# Altium schematic sheet Soft Quad Schematic.SchDoc
size A4; SheetNumber: 1; SheetTotal: 1
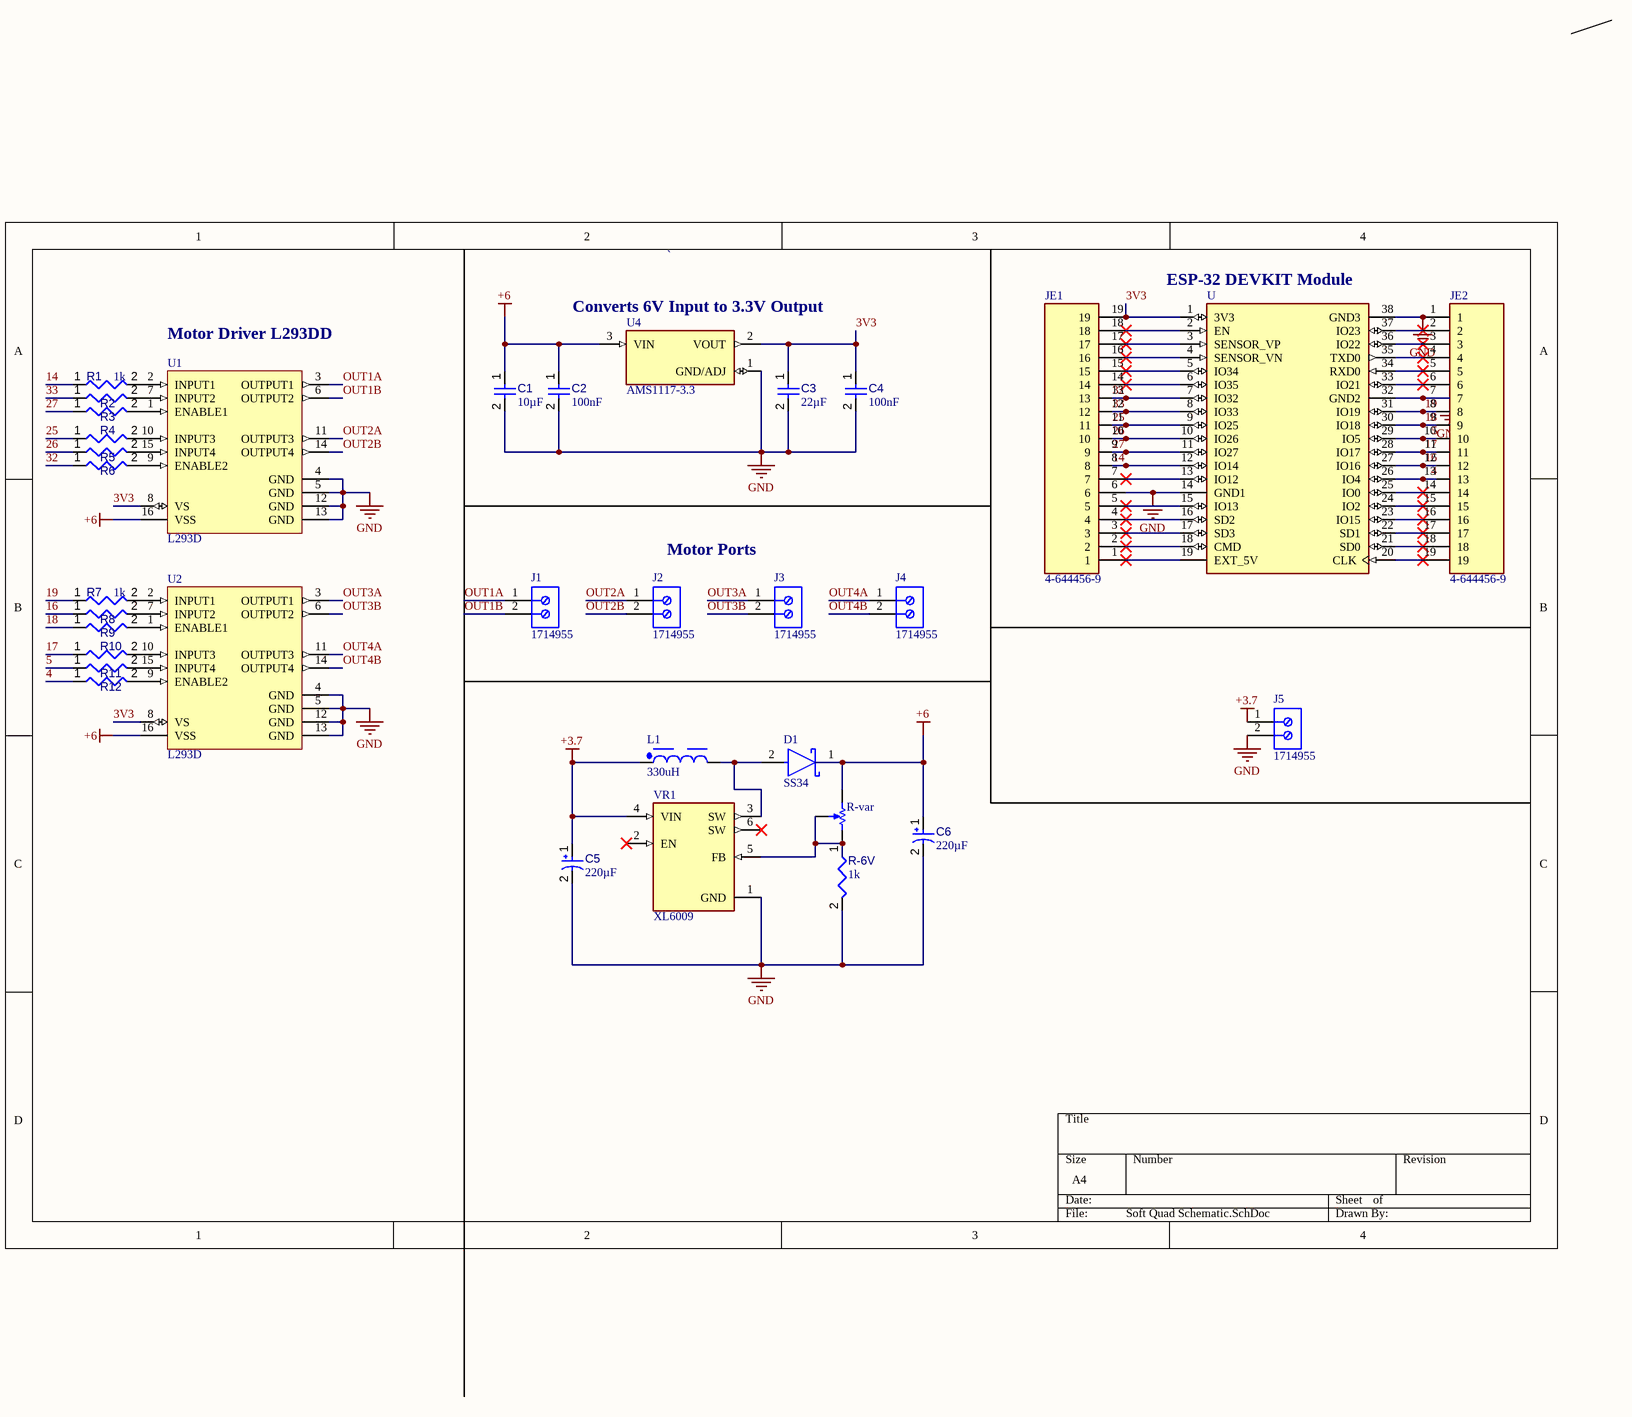
[diagram p0: Soft Quad Schematic.SchDoc]

## Parts
C1  value 10µF  [CAPC0603(1608)100_L]  (hidden comment: Capacitor 10µF +/-20% 10V 0603)
C2  value 100nF  [CAPC2013X95X50LL10T25]  (hidden comment: Capacitor 100 nF +/-10% 50 V 0805)
C3  value 22µF  [CAPC0805(2012)145_L]  (hidden comment: Capacitor 22µF +/-40% 16V 0805)
C4  value 100nF  [CAPC2013X95X50LL10T25]  (hidden comment: Capacitor 100 nF +/-10% 50 V 0805)
C5  value 220µF  [CAPMP7344X31-T_V]  (hidden comment: TPSD227K010R0150)
C6  value 220µF  [CAPMP7344X31-T_V]  (hidden comment: TPSD227K010R0150)
D1  SS34  [FP-95402-MFG]
J1  1714955  [PHOE-1714955_V]
J2  1714955  [PHOE-1714955_V]
J3  1714955  [PHOE-1714955_V]
J4  1714955  [PHOE-1714955_V]
J5  1714955  [PHOE-1714955_V]
JE1  4-644456-9  [TE_4-644456-9]
JE2  4-644456-9  [TE_4-644456-9]
L1  330uH  [WE-TPC_4818]
R1  value 1k  [RESC1608X55X25ML10T15]  (hidden comment: Resistor 1k +/-1% 0603 100 mW)
R2  Resistor 1k +/-1% 0603 100 mW  [RESC1608X55X25ML10T15]  (value not drawn)
R3  Resistor 1k +/-1% 0603 100 mW  [RESC1608X55X25ML10T15]  (value not drawn)
R4  Resistor 1k +/-1% 0603 100 mW  [RESC1608X55X25ML10T15]  (value not drawn)
R5  Resistor 1k +/-1% 0603 100 mW  [RESC1608X55X25ML10T15]  (value not drawn)
R6  Resistor 1k +/-1% 0603 100 mW  [RESC1608X55X25ML10T15]  (value not drawn)
R7  value 1k  [RESC1608X55X25ML10T15]  (hidden comment: Resistor 1k +/-1% 0603 100 mW)
R8  Resistor 1k +/-1% 0603 100 mW  [RESC1608X55X25ML10T15]  (value not drawn)
R9  Resistor 1k +/-1% 0603 100 mW  [RESC1608X55X25ML10T15]  (value not drawn)
R10  Resistor 1k +/-1% 0603 100 mW  [RESC1608X55X25ML10T15]  (value not drawn)
R11  Resistor 1k +/-1% 0603 100 mW  [RESC1608X55X25ML10T15]  (value not drawn)
R12  Resistor 1k +/-1% 0603 100 mW  [RESC1608X55X25ML10T15]  (value not drawn)
R-6V  value 1k  [RESC1608X55X25ML10T15]  (hidden comment: Resistor 1k +/-1% 0603 100 mW)
R-var  TC33X-2-103E  [BOUR-TC33X-2_V]  (value not drawn)
U  ESP32-DEVKITC  [MODULE_ESP32-DEVKITC]  (value not drawn)
U1  L293D  [STM-L293D-16]
U2  L293D  [STM-L293D-16]
U4  AMS1117-3.3  [SOT229P700X180-4N]
VR1  XL6009  [DPAK170P1435X465-6N]

## Nets
+3.7: C5.1 J5.1 L1.1 VR1.4(VIN)
+6: C1.1 C2.1 C6.1 D1.1(C) R-var.1 U1.16(VSS) U2.16(VSS) U4.3(VIN)
GND: C1.2 C2.2 C3.2 C4.2 C5.2 C6.2 J5.2 JE1.6 JE2.1 JE2.7 R-6V.2 U.14(GND1) U.32(GND2) U.38(GND3) U1.4(GND) U1.5(GND) U1.12(GND) U1.13(GND) U2.4(GND) U2.5(GND) U2.12(GND) U2.13(GND) U4.1(GND/ADJ) VR1.1(GND)
3V3: C3.1 C4.1 JE1.19 U.1(3V3) U1.8(VS) U2.8(VS) U4.2(VOUT)
4: JE2.13 R12.1 U.26(IO4)
5: JE2.10 R11.1 U.29(IO5)
14: JE1.8 R1.1 U.12(IO14)
16: JE2.12 R8.1 U.27(IO16)
17: JE2.11 R10.1 U.28(IO17)
18: JE2.9 R9.1 U.30(IO18)
19: JE2.8 R7.1 U.31(IO19)
25: JE1.11 R4.1 U.9(IO25)
26: JE1.10 R5.1 U.10(IO26)
27: JE1.9 R3.1 U.11(IO27)
32: JE1.13 R6.1 U.7(IO32)
33: JE1.12 R2.1 U.8(IO33)
OUT1A: J1.1 U1.3(OUTPUT1)
OUT1B: J1.2 U1.6(OUTPUT2)
OUT2A: J2.1 U1.11(OUTPUT3)
OUT2B: J2.2 U1.14(OUTPUT4)
OUT3A: J3.1 U2.3(OUTPUT1)
OUT3B: J3.2 U2.6(OUTPUT2)
OUT4A: J4.1 U2.11(OUTPUT3)
OUT4B: J4.2 U2.14(OUTPUT4)
NetD1_2: D1.2(A) L1.2 VR1.3(SW)
NetJE1_1: JE1.1 U.19(EXT_5V)
NetJE1_2: JE1.2 U.18(CMD)
NetJE1_3: JE1.3 U.17(SD3)
NetJE1_4: JE1.4 U.16(SD2)
NetJE1_5: JE1.5 U.15(IO13)
NetJE1_7: JE1.7 U.13(IO12)
NetJE1_14: JE1.14 U.6(IO35)
NetJE1_15: JE1.15 U.5(IO34)
NetJE1_16: JE1.16 U.4(SENSOR_VN)
NetJE1_17: JE1.17 U.3(SENSOR_VP)
NetJE1_18: JE1.18 U.2(EN)
NetJE2_2: JE2.2 U.37(IO23)
NetJE2_3: JE2.3 U.36(IO22)
NetJE2_4: JE2.4 U.35(TXD0)
NetJE2_5: JE2.5 U.34(RXD0)
NetJE2_6: JE2.6 U.33(IO21)
NetJE2_14: JE2.14 U.25(IO0)
NetJE2_15: JE2.15 U.24(IO2)
NetJE2_16: JE2.16 U.23(IO15)
NetJE2_17: JE2.17 U.22(SD1)
NetJE2_18: JE2.18 U.21(SD0)
NetJE2_19: JE2.19 U.20(CLK)
NetR1_2: R1.2 U1.2(INPUT1)
NetR2_2: R2.2 U1.7(INPUT2)
NetR3_2: R3.2 U1.1(ENABLE1)
NetR4_2: R4.2 U1.10(INPUT3)
NetR5_2: R5.2 U1.15(INPUT4)
NetR6_2: R6.2 U1.9(ENABLE2)
NetR7_2: R7.2 U2.2(INPUT1)
NetR8_2: R8.2 U2.7(INPUT2)
NetR9_2: R9.2 U2.1(ENABLE1)
NetR10_2: R10.2 U2.10(INPUT3)
NetR11_2: R11.2 U2.15(INPUT4)
NetR12_2: R12.2 U2.9(ENABLE2)
NetR-6V_1: R-6V.1 R-var.2 R-var.3 VR1.5(FB)

Not connected (* = marked no-connect by the designer): VR1 2(EN)* 6(SW)*

## Notes on the sheet
- `
- (near U4) Converts 6V Input to 3.3V Output
- (near U) ESP-32 DEVKIT Module
- Motor Driver L293DD
- Motor Ports

## Library data of the parts
C1 = CMP-001-00075-4: Chip Capacitor, 10µF +/-20%, 10V, 0603, Thickness 1 mm; Tolerance: 10%; Voltage Rating: 10V; Max Operating Temperature: 85°C; Pins: 2; Case/Package: 0603; Mounting Technology: SMT; Min Operating Temperature: -55°C
C2 C4 = CMP-001-00018-6: Chip Capacitor, 100 nF, +/- 10%, 50 V, 0805 (2012 Metric); Capacitor Type: Ceramic; Voltage Rating: 50V; Pins: 2; Max Operating Temperature: 125°C; Min Operating Temperature: -55°C; Mounting Technology: SM; Case/Package: 0805; RoHS Compliant: True; Tolerance: 10%
C3 = CMP-001-00081-4: Chip Capacitor, 22µF +/-40%, 16V, 0805, Thickness 1.45 mm; Tolerance: 5%; Voltage Rating: 16V; Mounting Technology: SMT; Pins: 2; Max Operating Temperature: 85°C; Case/Package: 0805; Min Operating Temperature: -55°C
C5 C6 = CMP-001-00051-7: Tantalum Capacitor, 220 uF, +/- 10%, 10 V, -55 to 125 degC, 2917 (7343 Metric), RoHS, Tape and Reel; Manufacturer: AVX Corporation; Voltage Rating: 10V; Case/Package: 2917; Datasheet URL: https://datasheet.ciiva.com/8080/1680477-8080379.pdf; Package Description: 2-Pin Surface Mount Device, Body 7.3 x 4.35 mm; Tolerance: 10%; RoHS Compliant: True; Capacitor Type: Tantalum; Manufacturer URL: http://www.avx.com/; Pins: 2; Package Quantity: 1; Max Operating Temperature: 125°C; Mounting Technology: SM; Packaging: TapeandReel; Datasheet Version: 42736; Package Reference: 7343-31; Min Operating Temperature: -55°C
D1 = CMP-02539-000012-1: DIODE SCHOTTKY 40V 3A DO214AB; Manufacturer: Vishay; Manufacturer Part Number: SS34-E3/57T; Max Junction Temp: +150°C; Peak Reverse Current: 0.5mA; Max Surge Forward Current: 100A; Standoff Height: 0mm; ComponentLink2Description: Datasheet; Device Class L3: Schottky Diodes; Height: 2.62mm; Max Repetitive Reverse Voltage: 40V; Lead Free: Yes; Package: 95402; Temperature Range High: +150°C; ComponentLink2URL: http://www.vishay.com/docs/88751/ss32.pdf; Temperature: -55°C to +150°C; Footprint Url: http://www.vishay.com/docs/95402/smc.pdf; Automotive: No; Forward Current: 3A; Category: Diode; RoHS: TRUE; Device Class L2: Diodes; Mouser Description: Schottky Diodes & Rectifiers 3.0 Amp 40 Volt; Octopart: https://octopart.com/ss34-e3%2F57t-vishay-39552907; Temperature Range Low: -55°C; Device Class L1: Discrete Semiconductors; Digikey Description: DIODE SCHOTTKY 40V 3A DO214AB
J1-J5 = CMP-2000-05797-1: PC Terminal Block, Pitch 6.35 mm, 1 x 2 Position, Height 21.5 mm, Tail Lenght 5.1 mm, RoHS, Bulk; Manufacturer: Phoenix Contact; Package Description: PC Terminal Block, Pitch 6.35 mm, 1 x 2 Position, Height 21.5 mm, Tail Lenght 5.1 mm; Datasheet URL: http://media.digikey.com/pdf/Data%20Sheets/Phoenix%20Contact%20PDFs/1714955.pdf; Package Reference: 1714955; Manufacturer URL: http://www.phoenixcontact.com/; Datasheet Version: 02/2010; Mounting Technology: ThroughHole
L1 = CMP-1479-00039-3: NexarPartId: 24533131; Inductance Tolerance: 30%; DC Resistance (DCR): 4.1Ω; Self Resonant Frequency: 5.5MHz; Current Rating: 150mA; Shielding: Shielded; Saturation Current: 130mA; Test Frequency: 100kHz; Inductance: 330µH; Core Material: Ferrite; Ambient Temperature Range Low: -40°C; REACH SVHC: Unknown; Termination: SMD/SMT; Min Operating Temperature: -40°C; RoHS: Compliant; Max Operating Temperature: 125°C; Packaging: Digi-Reel®; Max DC Current: 150mA; Case Code (Metric): 4848; Width: 4.8mm; Height: 1.8mm; Lead Free: Lead Free; Ambient Temperature Range High: 95°C; Height - Seated (Max): 2.0066mm; Case Code (Imperial): 1919; Case/Package: 1919; RMS Current (Irms): 150mA; Composition: Wirewound; Tolerance: 30%; Mount: Surface Mount; Length: 4.8mm; Number of Pins: 2
R1-R12 R-6V = CMP-009-00014-5: Chip Resistor, 1 KOhm, +/-1%, 0.1 W, -55 to 155 degC, 0603 (1608 Metric); Voltage Rating: 50V; Power: 100mW; Tolerance: 1%; Mounting Technology: SM; Pins: 2; Case/Package: 0603; Min Operating Temperature: -55°C; RoHS Compliant: True; Max Operating Temperature: 155°C
  R3-R6 R9-R12: Value: 1k
R-var = CMP-009-00060-2: Trimming Potentiometer, 10000 Ohm, -40 to 100 degC, 3-Pin SMD, RoHS, Tape and Reel; Manufacturer: Bourns; Tolerance: 25%; Power: 100mW; Resistance: 10k; Max Operating Temperature: 120°C; Package Description: 3-Pin Surface Mount Device, Body 3.8 x 3.6 mm; Datasheet Version: Aug-16; RoHS Compliant: True; Mounting Technology: SM; Package Quantity: 2500; Manufacturer URL: http://www.bourns.com/; Datasheet URL: http://www.bourns.com/docs/Product-Datasheets/TC33.pdf; Case/Package: TC33X-2; Package Reference: TC33X-2; Composition: Potentiometer; Packaging: TapeandReel; Min Operating Temperature: -40°C
U = ESP32-DEVKITC: - Transceiver; 802.11 b/g/n _Wi-Fi, WiFi, WLAN_, BluetoothÂ® Smart Ready 4.x Dual Mode For Use With ESP-WROOM-32; MP: ESP32-DEVKITC-32D-F; MF: Espressif Systems; Price: None; SnapEDA_Link: https://www.snapeda.com/parts/ESP32-DEVKITC-32D-F/Espressif%20Systems/view-part/4220172/?ref=snap; Availability: Unavailable; Value: *; Package: None
U1 U2 = CMP-2000-06524-1: Push-Pull Four Channel Driver with Diode, 4.5 to 36 V, -40 to 150 degC, 16-Pin PDIP, RoHS, Tube; Manufacturer: STMicroelectronics; Number of Outputs: 4; Current - Peak Output: 1.2A; Current - Output / Channel: 600mA; Input Type: Non-Inverting; Other Related Documents: L293DViewAllSpecifications; Dynamic Catalog: HalfBridge; Voltage - Supply: 4.5V~36V; Other Names: 497-2936-5; Package / Case: 16-DIP(0.300",7.62mm); PartNumber: L293D; Operating Temperature: -40°C~150°C; Datasheet URL: http://www.st.com/st-web-ui/static/active/en/resource/technical/document/datasheet/CD00000059.pdf; Supplier Device Package: 16-PowerDIP; Packaging: Tube; Package Description: 16-Pin Thru-Hole Dual-In-Line, Body 20 x 6.85 mm, Pitch 2.54 mm; Standard Package: 25; Datasheet Version: 07/2003; On-State Resistance: -; Manufacturer URL: http://www.st.com/; Category: IntegratedCircuits(ICs); Family: PMIC-MOSFET,BridgeDrivers-InternalSwitch; Type: HalfBridge; Series: -; Mounting Technology: ThroughHole; Package Reference: DIP-16; Mounting Type: ThroughHole
U4 = AMS1117-3.3: Sot223/Pkg 1-Amp 3.3-Volt Low Drop Out Voltage Regulatator; MF: Advanced Monolithic Systems; Package: SOT-223 Seeed Technology; Value: *; Check_prices: https://www.snapeda.com/parts/AMS1117-3.3/Advanced+Monolithic+Systems/view-part/?ref=eda; Price: None; Availability: Not in stock; MP: AMS1117-3.3; SnapEDA_Link: https://www.snapeda.com/parts/AMS1117-3.3/Advanced+Monolithic+Systems/view-part/?ref=snap
VR1 = CMP-003-000000-1: The XL6009 regulator is a wide input range, current mode, DC/DC converter which is capable of generating either positive or negative output voltages.; MF: XLSEMI; Component Type: Standard; Source: XL6009.SchLib; Value: *; SnapEDA_Link: https://www.snapeda.com/parts/XL6009/XLSEMI/view-part/?ref=snap; Design Item ID: XL6009; Check_prices: https://www.snapeda.com/parts/XL6009/XLSEMI/view-part/?ref=eda; Price: None; Pin Count: 6; Package: TO-263-5L XLSEMI; Availability: Not in stock; MP: XL6009
JE1 JE2 = 4-644456-9: Package: None; Price: None; Value: *; MP: 4-644456-9; Availability: Unavailable